# Altium schematic sheet V1.0.SchDoc
size 88 x 50 mm
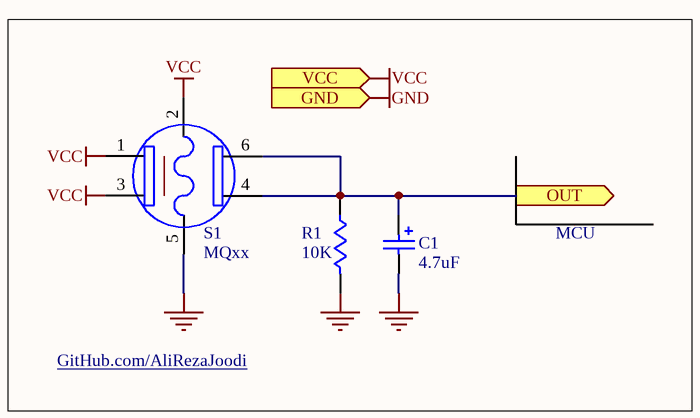
[diagram p0: V1.0.SchDoc]

## Parts
C1  value 4.7uF  [CAPPR2.5-6.3x5]  (hidden comment: Cap Pol1)
R1  value 10K  [AXIAL-0.4]  (hidden comment: Res1)
S1  MQxx  [MQxx]

## Ports
GND, OUT (out), VCC

## Nets
GND: C1.2 R1.2 S1.5 ; port GND
VCC: S1.1 S1.2 S1.3 ; port VCC
OUT: C1.1 R1.1 S1.4 S1.6 ; port OUT

## Notes on the sheet
- MCU
- GitHub.com/AliRezaJoodi

## Library data of the parts
C1 = Cap Pol1: Polarized Capacitor (Radial); Manufacturer: Generic Components; Class I: Passive; Published: 8-Jun-2000; Revision: July-2002: Re-released for DXP Platform.; Publisher: Altium Limited; Class II: Capacitor
R1 = Res1: Resistor; Manufacturer: Generic Components; Class I: Passive; Published: 8-Jun-2000; Revision: July-2002: Re-released for DXP Platform.; Publisher: Altium Limited; Class II: Resistor
S1 = MQ: Gas Sensor; Manufacturer: Generic Components; Class I: Passive; Class II: Inductor; Published: 8-Jun-2000; Revision: July-2002: Re-released for DXP Platform.; Publisher: Altium Limited; Value: MQxx